# Altium schematic sheet LM25118.schdoc
size 441 x 220 mm; SheetNumber: 1; SheetTotal: 1
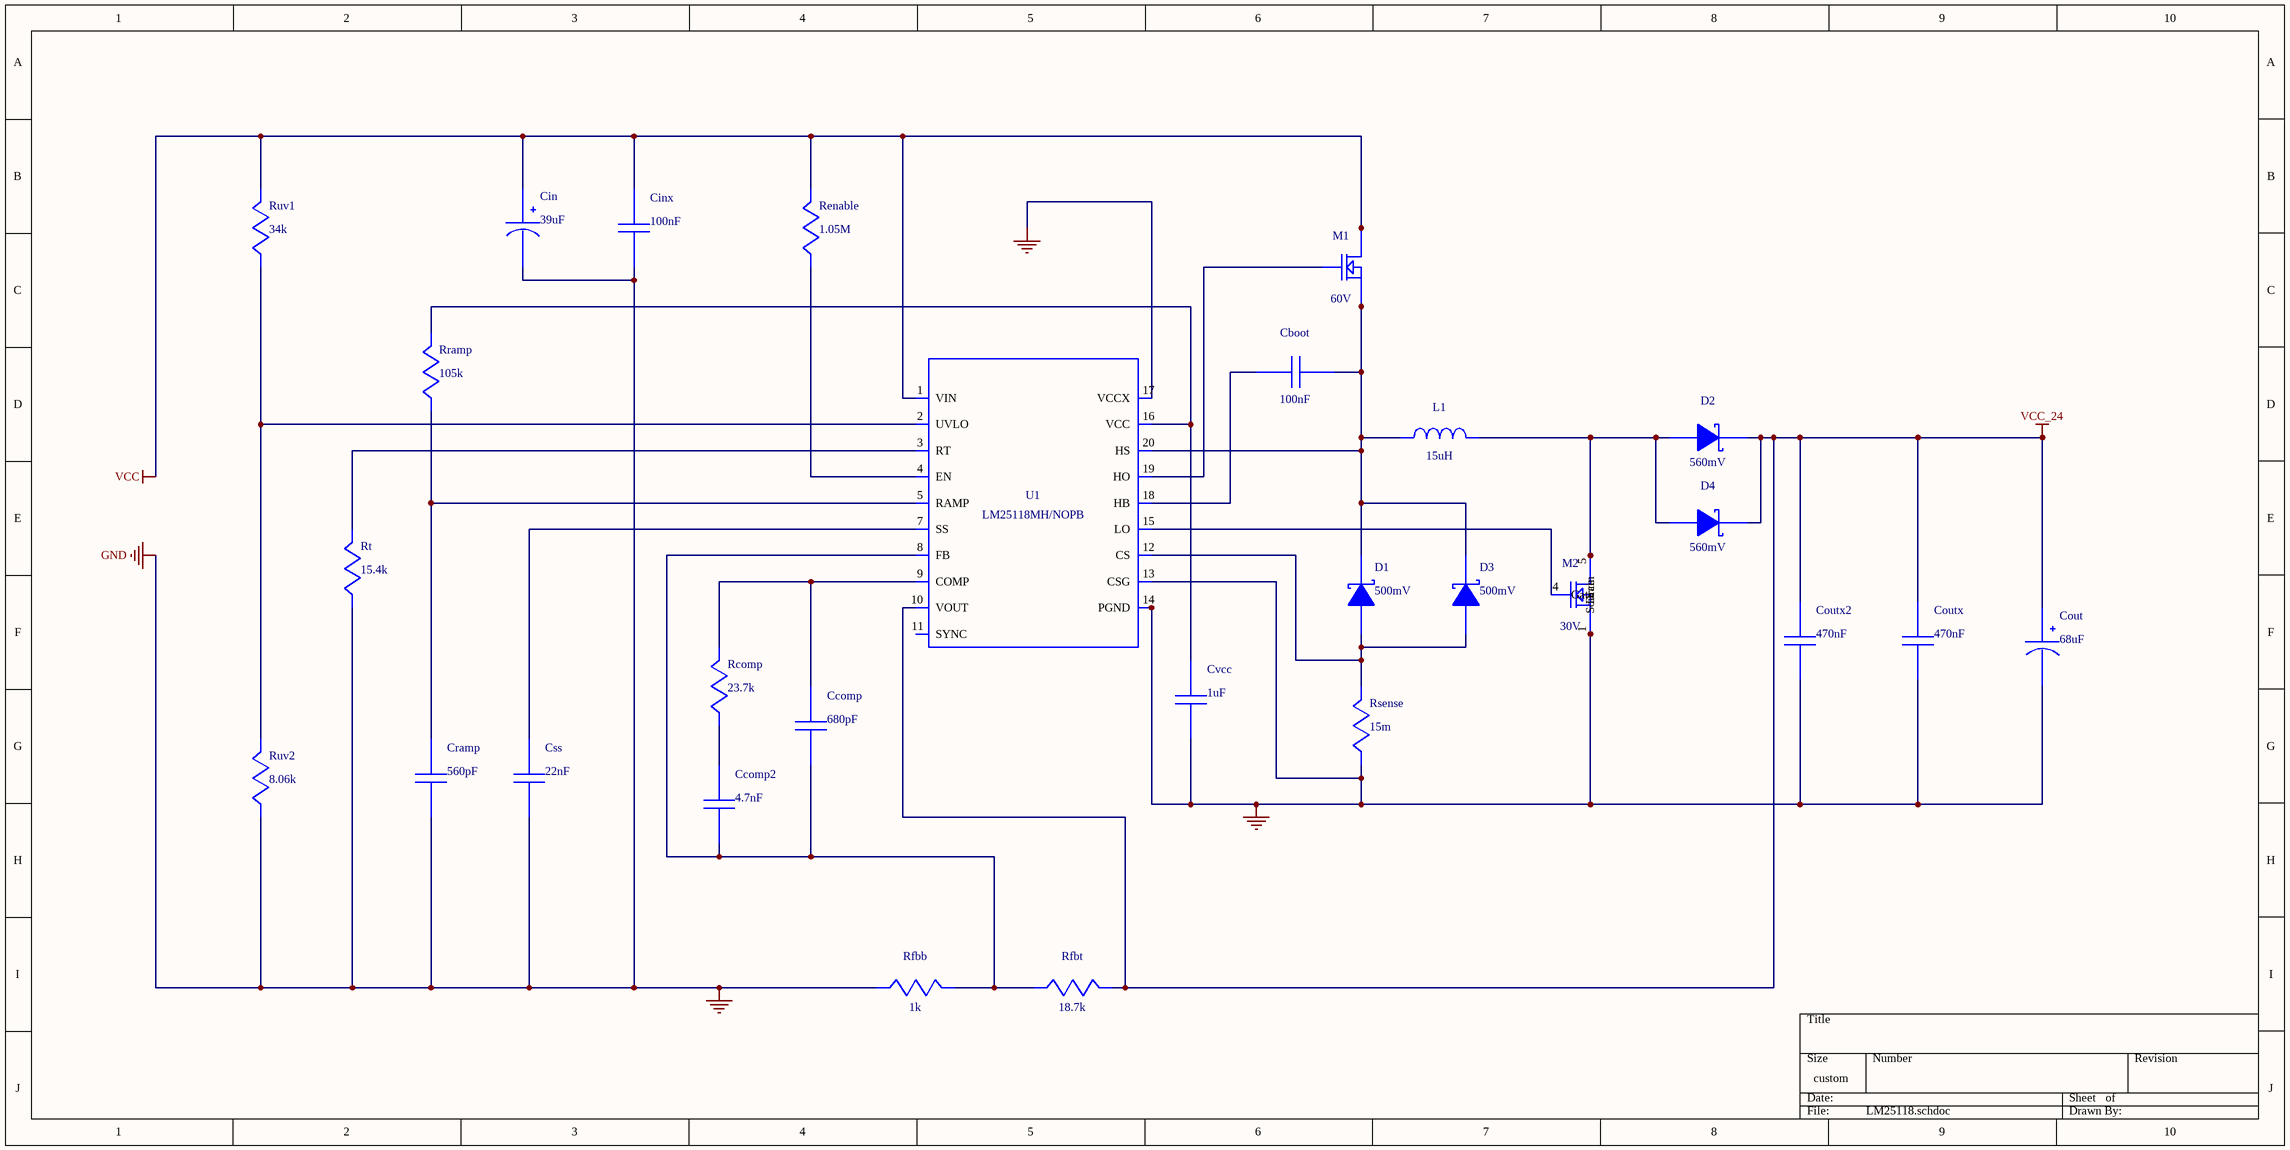
[diagram p0: LM25118.schdoc]

## Parts
Cboot  value 100nF  (hidden comment: 08053C104JAZ2A)
Ccomp  value 680pF  (hidden comment: CGA2B2C0G1H681J050BA)
Ccomp2  value 4.7nF  (hidden comment: CGA4C2C0G1H472J060AA)
Cin  value 39uF  (hidden comment: 50SVPF39M)
Cinx  value 100nF  (hidden comment: C1005X7R1H104K050BB)
Cout  value 68uF  (hidden comment: 50SVPF68M)
Coutx  value 470nF  (hidden comment: C1608X7R1H474K080AC)
Coutx2  value 470nF  (hidden comment: C1608X7R1H474K080AC)
Cramp  value 560pF  (hidden comment: GRM1555C1H561JA01J)
Css  value 22nF  (hidden comment: CGA4J2C0G1H223J125AA)
Cvcc  value 1uF  (hidden comment: C1608X5R1H105K080AB)
D1  value 500mV  (hidden comment: B340A-13-F)
D2  value 560mV  (hidden comment: PDS760-13)
D3  value 500mV  (hidden comment: B340A-13-F)
D4  value 560mV  (hidden comment: PDS760-13)
L1  value 15uH  (hidden comment: XAL1010-153MEB)
M1  value 60V  (hidden comment: BSZ100N06LS3 G)
M2  value 30V  (hidden comment: CSD17308Q3)
Rcomp  value 23.7k  (hidden comment: RC0201FR-0723K7L)
Renable  value 1.05M  (hidden comment: CRCW04021M05FKED)
Rfbb  value 1k  (hidden comment: ERJ-6ENF1001V)
Rfbt  value 18.7k  (hidden comment: RC0201FR-0718K7L)
Rramp  value 105k  (hidden comment: RC0201FR-07105KL)
Rsense  value 15m  (hidden comment: PRL1632-R015-F-T1)
Rt  value 15.4k  (hidden comment: RC0201FR-0715K4L)
Ruv1  value 34k  (hidden comment: CRCW040234K0FKED)
Ruv2  value 8.06k  (hidden comment: CRCW04028K06FKED)
U1  LM25118MH/NOPB

## Nets
0: Cin.2(-) Cinx.2 Cout.2(-) Coutx.2 Coutx2.2 Cramp.2 Css.2 Cvcc.2 M2.1(Source) M2.2(Source) M2.3(Source) Rfbb.2 Rsense.2 Rt.2 Ruv2.2 U1.6(AGND) U1.13(CSG) U1.14(PGND) U1.17(VCCX) U1.21(EXP-PAD)  [also labelled GND]
VCC: Cin.1(+) Cinx.1 M1.5(Drain) M1.6(Drain) M1.7(Drain) M1.8(Drain) M1.9(Drain) Renable.1 Ruv1.1 U1.1(VIN)
VCC_24: Cout.1(+) Coutx.1 Coutx2.1 D2.2(K) D4.2(K) Rfbt.1 U1.10(VOUT)
NetCboot_1: Cboot.1 D1.1(K) D3.1(K) L1.2 M1.1(Source) M1.2(Source) M1.3(Source) U1.20(HS)
NetCboot_2: Cboot.2 U1.18(HB)
NetCcomp2_1: Ccomp2.1 Rcomp.2
NetCcomp_1: Ccomp.1 Rcomp.1 U1.9(COMP)
NetCcomp_2: Ccomp.2 Ccomp2.2 Rfbb.1 Rfbt.2 U1.8(FB)
NetCramp_1: Cramp.1 Rramp.2 U1.5(RAMP)
NetCss_1: Css.1 U1.7(SS)
NetCvcc_1: Cvcc.1 Rramp.1 U1.16(VCC)
NetD1_2: D1.2(A) D3.2(A) Rsense.1 U1.12(CS)
NetD2_1: D2.1(A) D4.1(A) L1.1 M2.5(Drain) M2.6(Drain) M2.7(Drain) M2.8(Drain) M2.9(Drain)
NetM1_4: M1.4(Gate) U1.19(HO)
NetM2_4: M2.4(Gate) U1.15(LO)
NetRenable_2: Renable.2 U1.4(EN)
NetRt_1: Rt.1 U1.3(RT)
NetRuv1_2: Ruv1.2 Ruv2.1 U1.2(UVLO)

Not connected (* = marked no-connect by the designer): U1 11(SYNC)

## Library data of the parts
Cboot = 08053C104JAZ2A: Manufacturer Name: AVX; PackageReference: 08053C104JAZ2A; Manufacturer Part Number: 08053C104JAZ2A
Ccomp = CGA2B2C0G1H681J050BA: CGA2B2C0G1H681J0; Manufacturer Name: TDK; PackageReference: CGA2B2C0G1H681J050BA; Manufacturer Part Number: CGA2B2C0G1H681J050BA
Ccomp2 = CGA4C2C0G1H472J060AA: CGA4C2C0G1H472J0; Manufacturer Name: TDK; PackageReference: CGA4C2C0G1H472J060AA; Manufacturer Part Number: CGA4C2C0G1H472J060AA
Cin = 50SVPF39M: Manufacturer Name: Panasonic; PackageReference: 50SVPF39M; Manufacturer Part Number: 50SVPF39M
Cinx = C1005X7R1H104K050BB: C1005X7R1H104K05; Manufacturer Name: TDK; PackageReference: C1005X7R1H104K050BB; Manufacturer Part Number: C1005X7R1H104K050BB
Cout = 50SVPF68M: Manufacturer Name: Panasonic; PackageReference: 50SVPF68M; Manufacturer Part Number: 50SVPF68M
Coutx Coutx2 = C1608X7R1H474K080AC: C1608X7R1H474K08; Manufacturer Name: TDK; PackageReference: C1608X7R1H474K080AC; Manufacturer Part Number: C1608X7R1H474K080AC
Cramp = GRM1555C1H561JA01J: GRM1555C1H561JA0; Manufacturer Name: MuRata; PackageReference: GRM1555C1H561JA01J; Manufacturer Part Number: GRM1555C1H561JA01J
Css = CGA4J2C0G1H223J125AA: CGA4J2C0G1H223J1; Manufacturer Name: TDK; PackageReference: CGA4J2C0G1H223J125AA; Manufacturer Part Number: CGA4J2C0G1H223J125AA
Cvcc = C1608X5R1H105K080AB: C1608X5R1H105K08; Manufacturer Name: TDK; PackageReference: C1608X5R1H105K080AB; Manufacturer Part Number: C1608X5R1H105K080AB
D1 D3 = B340A-13-F: Manufacturer Name: Diodes Inc.; PackageReference: B340A-13-F; Manufacturer Part Number: B340A-13-F
D2 D4 = PDS760-13: Manufacturer Name: Diodes Inc.; PackageReference: PDS760-13; Manufacturer Part Number: PDS760-13
L1 = XAL1010-153MEB: Manufacturer Name: Coilcraft; PackageReference: XAL1010-153MEB; Manufacturer Part Number: XAL1010-153MEB
M1 = BSZ100N06LS3 G: Manufacturer Name: Infineon Technologies; PackageReference: BSZ100N06LS3 G; Manufacturer Part Number: BSZ100N06LS3 G
M2 = CSD17308Q3: Manufacturer Name: Texas Instruments; PackageReference: CSD17308Q3; Manufacturer Part Number: CSD17308Q3
Rcomp = RC0201FR-0723K7L: Manufacturer Name: Yageo; PackageReference: RC0201FR-0723K7L; Manufacturer Part Number: RC0201FR-0723K7L
Renable = CRCW04021M05FKED: Manufacturer Name: Vishay-Dale; PackageReference: CRCW04021M05FKED; Manufacturer Part Number: CRCW04021M05FKED
Rfbb = ERJ-6ENF1001V: Manufacturer Name: Panasonic; PackageReference: ERJ-6ENF1001V; Manufacturer Part Number: ERJ-6ENF1001V
Rfbt = RC0201FR-0718K7L: Manufacturer Name: Yageo; PackageReference: RC0201FR-0718K7L; Manufacturer Part Number: RC0201FR-0718K7L
Rramp = RC0201FR-07105KL: Manufacturer Name: Yageo; PackageReference: RC0201FR-07105KL; Manufacturer Part Number: RC0201FR-07105KL
Rsense = PRL1632-R015-F-T1: PRL1632-R015-F-T; Manufacturer Name: Susumu Co Ltd; PackageReference: PRL1632-R015-F-T1; Manufacturer Part Number: PRL1632-R015-F-T1
Rt = RC0201FR-0715K4L: Manufacturer Name: Yageo; PackageReference: RC0201FR-0715K4L; Manufacturer Part Number: RC0201FR-0715K4L
Ruv1 = CRCW040234K0FKED: Manufacturer Name: Vishay-Dale; PackageReference: CRCW040234K0FKED; Manufacturer Part Number: CRCW040234K0FKED
Ruv2 = CRCW04028K06FKED: Manufacturer Name: Vishay-Dale; PackageReference: CRCW04028K06FKED; Manufacturer Part Number: CRCW04028K06FKED
U1 = LM25118MH/NOPB: Manufacturer Name: Texas Instruments; PackageReference: LM25118MH/NOPB; Manufacturer Part Number: LM25118MH/NOPB; Value: Value